# Altium schematic sheet Accelerometer.SchDoc
size A
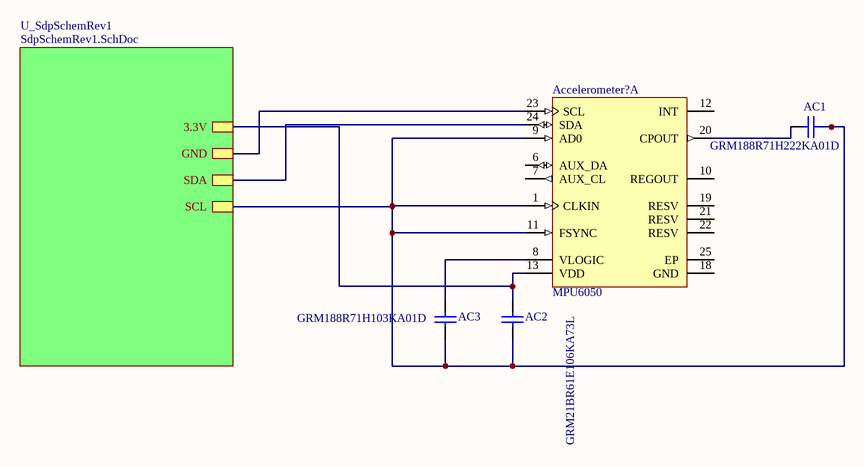
[diagram p0: Accelerometer.SchDoc]

## Parts
AC1  GRM188R71H222KA01D  [CAPC1608X90X35NL10T15]
AC2  GRM21BR61E106KA73L  [CAPC2013X135X45ML10T25]
AC3  GRM188R71H103KA01D  [CAPC1608X90X35ML10T15]
Accelerometer?  MPU6050  [INSE-QFN-24_V]  (part A of 2)

## Sub-sheets
U_SdpSchemRev1 = SdpSchemRev1.SchDoc: 3.3V, GND, SDA, SCL

## Nets
NetAC1_1: AC1.1 Accelerometer?.20(CPOUT)
NetAC1_2: AC1.2 AC2.1 AC3.1 Accelerometer?.1(CLKIN) Accelerometer?.9(AD0) Accelerometer?.11(FSYNC) ; sheet U_SdpSchemRev1/SCL
NetAC2_2: AC2.2 Accelerometer?.13(VDD) ; sheet U_SdpSchemRev1/3.3V
NetAC3_2: AC3.2 Accelerometer?.8(VLOGIC)
NetAccelerometer?_23: Accelerometer?.23(SCL) ; sheet U_SdpSchemRev1/GND
NetAccelerometer?_24: Accelerometer?.24(SDA) ; sheet U_SdpSchemRev1/SDA

Not connected (* = marked no-connect by the designer): Accelerometer? 6(AUX_DA) 7(AUX_CL) 10(REGOUT) 12(INT) 18(GND) 19(RESV) 21(RESV) 22(RESV) 25(EP)

## Library data of the parts
AC1 = CMP-1662-00006-4: Chip Capacitor, 2.2 nF, +/- 10%, 50 V, -55 to 125 degC, 0603 (1608 Metric), RoHS, Tape and Reel; Manufacturer: Murata; Voltage Rating: 50 V; Pins: 2; Mount: Surface Mount; Max Operating Temperature: 125 degC; ComponentLink1Description: Manufacturer URL; RoHSCompliant: true; PackageDescription: 2-Pin Surface Mount Device, Body 1.6 x 0.8 mm; ComponentLink2URL: http://search.murata.co.jp/Ceramy/image/img/A01X/G101/ENG/GRM188R71H222KA01-01.pdf; PackageReference: 0603; Height: 0.8 mm; Lead Pitch: 4 mm; Packaging: Tape and Reel; DatasheetVersion: 02/2016; Mounting Technology: Surface Mount; ComponentLink2Description: Datasheet; Min Operating Temperature: -55 degC; Length: 1.6 mm; REACH SVHC: No SVHC; Package Quantity: 4000; ComponentLink1URL: http://www.murata.com/
AC2 = CMP-2007-03541-1: Manufacturer: Murata; Part Number: GRM21BR61E106KA73L
AC3 = CMP-2100-03642-1: Chip Capacitor, 10 nF, +/- 10%, 50 V, -55 to 125 degC, 0603 (1608 Metric), RoHS, Tape and Reel; Manufacturer: Murata; Insulation Resistance: 10GR; Dielectric: X7R; Voltage Rating: 50V; Capacitance: 10nF; Dielectric Material: Ceramic; Package Quantity: 1; Lead Free: LeadFree; Case/Package: 0603; Termination: SMD/SMT; REACH SVHC: Unknown; Manufacturer URL: http://www.murata.com/; Datasheet URL: http://search.murata.co.jp/Ceramy/image/img/A01X/G101/ENG/GRM188R71H103KA01-01.pdf; Mount: SurfaceMount; Datasheet Version: 42401.0; Number of Pins: 2; Length: 1.6mm; Voltage: 50V; Depth: 0.8mm; Tolerance: 10%; Min Operating Temperature: -55degC; Voltage Rating (DC): 50V; Max Operating Temperature: 125degC; Package Description: 2-Pin Surface Mount Device, Body 1.6 x 0.8 mm; RoHSCompliant: True; Case Code (Imperial): 0603; Width: 0.031inch; Case Code (Metric): 1608; Height: 0.8mm; Package Reference: 0603; Packaging: TapeandReel; Thickness: 0.035inch; Material: Ceramic
Accelerometer? = CMP-1753-00002-1: 3-Axis Gyroscope, 3-Axis Accelerometer / , 2.375 to 3.46 V, -40 to 105 degC, 24-Pin QFN, RoHS, Tape and Reel; Resistance: 5.6 kohm; Tolerance: 1%; Voltage Rating: 75 V; Power Rating: 100 mW; ComponentLink1Description: Manufacturer URL; Mount: Surface Mount; Max Operating Temperature: 155degC; Package Quantity: 5000; ComponentLink2Description: Datasheet; Pins: 2; Packaging: Tape and Reel; Case Code (Imperial): 0603; PackageReference: QFN-24; ComponentLink2URL: https://datasheet.ciiva.com/1513/1788002-1513632.pdf; Radiation Hardening: No; ComponentLink1URL: http://www.invensense.com/; PackageDescription: 24-Pin Quad Flat No-lead Package, Body 4 x 4 mm, Pitch 0.5 mm; Height: 0.45 mm; Case/Package: 0603; Case Code (Metric): 1608; REACH SVHC: Yes; Min Operating Temperature: -55degC; DatasheetVersion: Rev. 3.4, 08/2013; Width: 0.8 mm; RoHSCompliant: True; Length: 1.6 mm